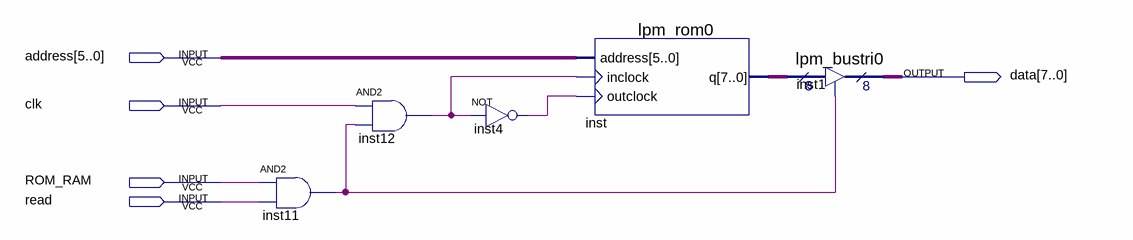
[diagram p0: schematic sheet]
// Quartus schematic lab3ROM.bdf as structural Verilog: 5 symbols, 5 pins
module lab3ROM (
  input  [5:0] address,
  input  clk,
  input  ROM_RAM,
  input  read,
  output [7:0] data
);

  wire inst4_out, inst11_out, inst12_out;
  wire [7:0] inst_q;

  and inst11 (inst11_out, ROM_RAM, read);
  and inst12 (inst12_out, clk, inst11_out);
  not inst4 (inst4_out, inst12_out);
  lpm_rom0 inst (.address(address), .inclock(inst12_out), .outclock(inst4_out), .q(inst_q));
  lpm_bustri0 inst1 (.enabledt(inst11_out), .data(inst_q), .tridata(data));
endmodule
